# Altium schematic sheet deco+res.SchDoc
size A4
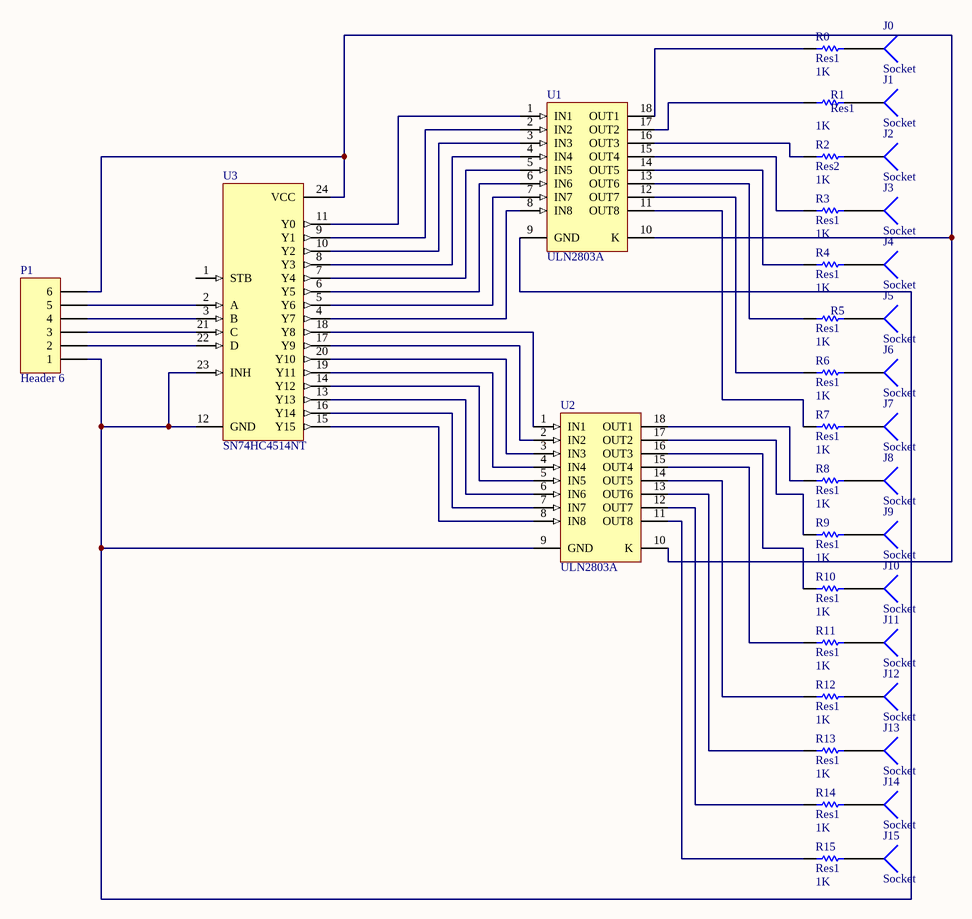
[diagram p0: deco+res.SchDoc]

## Parts
J0  Socket  [PIN1]
J1  Socket  [PIN1]
J2  Socket  [PIN1]
J3  Socket  [PIN1]
J4  Socket  [PIN1]
J5  Socket  [PIN1]
J6  Socket  [PIN1]
J7  Socket  [PIN1]
J8  Socket  [PIN1]
J9  Socket  [PIN1]
J10  Socket  [PIN1]
J11  Socket  [PIN1]
J12  Socket  [PIN1]
J13  Socket  [PIN1]
J14  Socket  [PIN1]
J15  Socket  [PIN1]
P1  Header 6  [HDR1X6]
R0  Res1  value 1K  [AXIAL-0.3]
R1  Res1  value 1K  [AXIAL-0.3]
R2  Res2  value 1K  [AXIAL-0.3]
R3  Res1  value 1K  [AXIAL-0.3]
R4  Res1  value 1K  [AXIAL-0.3]
R5  Res1  value 1K  [AXIAL-0.3]
R6  Res1  value 1K  [AXIAL-0.3]
R7  Res1  value 1K  [AXIAL-0.3]
R8  Res1  value 1K  [AXIAL-0.3]
R9  Res1  value 1K  [AXIAL-0.3]
R10  Res1  value 1K  [AXIAL-0.3]
R11  Res1  value 1K  [AXIAL-0.3]
R12  Res1  value 1K  [AXIAL-0.3]
R13  Res1  value 1K  [AXIAL-0.3]
R14  Res1  value 1K  [AXIAL-0.3]
R15  Res1  value 1K  [AXIAL-0.3]
U1  ULN2803A  [707-02]
U2  ULN2803A  [707-02]
U3  SN74HC4514NT  [NT024]

## Nets
NetJ0_1: J0.1 R0.2
NetJ1_1: J1.1 R1.2
NetJ2_1: J2.1 R2.2
NetJ3_1: J3.1 R3.2
NetJ4_1: J4.1 R4.2
NetJ5_1: J5.1 R5.2
NetJ6_1: J6.1 R6.2
NetJ7_1: J7.1 R7.2
NetJ8_1: J8.1 R8.2
NetJ9_1: J9.1 R9.2
NetJ10_1: J10.1 R10.2
NetJ11_1: J11.1 R11.2
NetJ12_1: J12.1 R12.2
NetJ13_1: J13.1 R13.2
NetJ14_1: J14.1 R14.2
NetJ15_1: J15.1 R15.2
NetP1_1: P1.1 U1.9(GND) U2.9(GND) U3.12(GND) U3.23(INH)
NetP1_2: P1.2 U3.22(D)
NetP1_3: P1.3 U3.21(C)
NetP1_4: P1.4 U3.3(B)
NetP1_5: P1.5 U3.2(A)
NetP1_6: P1.6 U1.10(K) U2.10(K) U3.24(VCC)
NetR0_1: R0.1 U1.18(OUT1)
NetR1_1: R1.1 U1.17(OUT2)
NetR2_1: R2.1 U1.16(OUT3)
NetR3_1: R3.1 U1.15(OUT4)
NetR4_1: R4.1 U1.14(OUT5)
NetR5_1: R5.1 U1.13(OUT6)
NetR6_1: R6.1 U1.12(OUT7)
NetR7_1: R7.1 U1.11(OUT8)
NetR8_1: R8.1 U2.18(OUT1)
NetR9_1: R9.1 U2.17(OUT2)
NetR10_1: R10.1 U2.16(OUT3)
NetR11_1: R11.1 U2.15(OUT4)
NetR12_1: R12.1 U2.14(OUT5)
NetR13_1: R13.1 U2.13(OUT6)
NetR14_1: R14.1 U2.12(OUT7)
NetR15_1: R15.1 U2.11(OUT8)
NetU1_1: U1.1(IN1) U3.11(Y0)
NetU1_2: U1.2(IN2) U3.9(Y1)
NetU1_3: U1.3(IN3) U3.10(Y2)
NetU1_4: U1.4(IN4) U3.8(Y3)
NetU1_5: U1.5(IN5) U3.7(Y4)
NetU1_6: U1.6(IN6) U3.6(Y5)
NetU1_7: U1.7(IN7) U3.5(Y6)
NetU1_8: U1.8(IN8) U3.4(Y7)
NetU2_1: U2.1(IN1) U3.18(Y8)
NetU2_2: U2.2(IN2) U3.17(Y9)
NetU2_3: U2.3(IN3) U3.20(Y10)
NetU2_4: U2.4(IN4) U3.19(Y11)
NetU2_5: U2.5(IN5) U3.14(Y12)
NetU2_6: U2.6(IN6) U3.13(Y13)
NetU2_7: U2.7(IN7) U3.16(Y14)
NetU2_8: U2.8(IN8) U3.15(Y15)

Not connected (* = marked no-connect by the designer): U3 1(STB)

## Library data of the parts
P1 = Header 6: Header, 6-Pin; LatestRevisionDate: 17-Jul-2002; LatestRevisionNote: Re-released for DXP Platform.; Publisher: Altium Limited
R0-R15 = Res1: Resistor; Published: 8-Jun-2000; LatestRevisionDate: 17-Jul-2002; LatestRevisionNote: Re-released for DXP Platform.; PackageReference: AXIAL-0.3; Publisher: Altium Limited; PackageDescription: Axial Device, Thru-Hole; 2 Leads; 0.3 in Pin Spacing
U1 U2 = ULN2803A: Octal Peripheral Driver Array; Published: 17-Jul-2002; LatestRevisionDate: 06-Jun-2005; LatestRevisionNote: Stylized 3D Model Added.; DatasheetVersion: 1988; PackageReference: 707-02; Publisher: Altium Limited; PackageDescription: DIP; 18 Leads; Row Spacing 7.62 mm; Pitch 2.54 mm
U3 = SN74HC4514NT: 4-Line to 16-Line Decoder / Demultiplexer with Address Latches; ComponentAvailability: Obsolete; Published: 8-Jun-2000; LatestRevisionDate: 04-Mar-2005; LatestRevisionNote: Stylized 3D Model Added.; DatasheetVersion: Jun-1989; PackageVersion: Oct-1994; PackageReference: NT024; Publisher: Altium Limited; PackageDescription: DIP; 24 Leads; Row Spacing 7.62 mm; Pitch 2.54 mm; Code_JEDEC: MS-001-AF; ComponentLink1Description: Manufacturer Link; ComponentLink1URL: http://www.ti.com/; ComponentLink2Description: Datasheet; ComponentLink2URL: http://www-s.ti.com/sc/ds/sn74hc4514.pdf
J0-J15 = Socket: LatestRevisionDate: 17-Jul-2002; LatestRevisionNote: Re-released for DXP Platform.; Publisher: Altium Limited